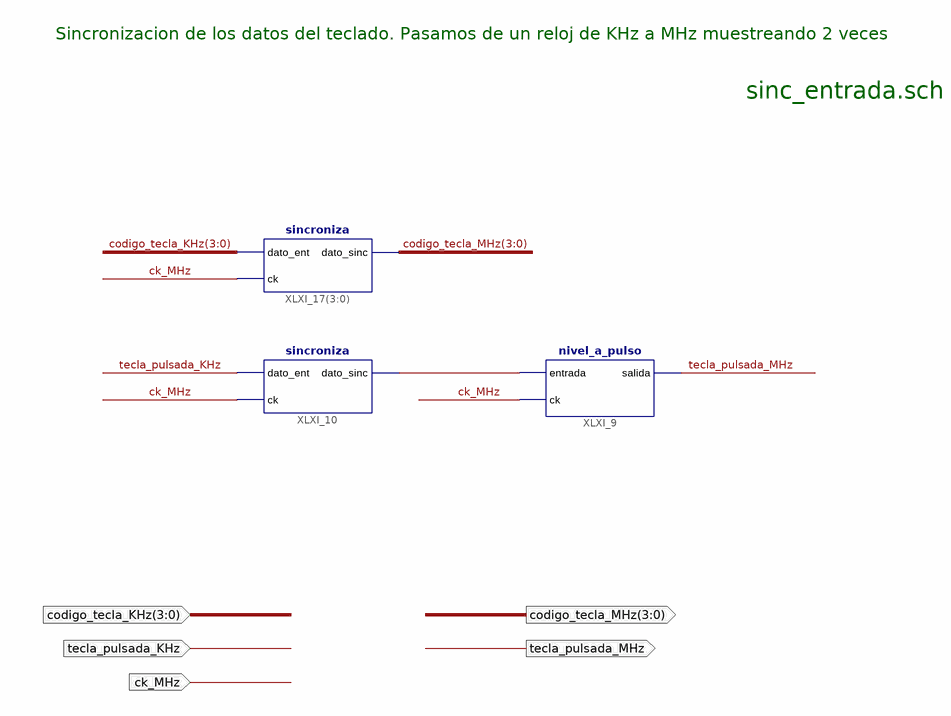
[diagram p0: schematic sheet 1]
// Xilinx ISE schematic sinc_entrada.sch (spartan6) as structural Verilog: 3 symbols, 5 ports
module sinc_entrada (
  input  [3:0] codigo_tecla_KHz,
  input  ck_MHz,
  input  tecla_pulsada_KHz,
  output [3:0] codigo_tecla_MHz,
  output tecla_pulsada_MHz
);

  wire XLXN_33;

  nivel_a_pulso XLXI_9 (.salida(tecla_pulsada_MHz), .ck(ck_MHz), .entrada(XLXN_33));
  sincroniza XLXI_10 (.dato_sinc(XLXN_33), .ck(ck_MHz), .dato_ent(tecla_pulsada_KHz));
  sincroniza XLXI_17[3:0] (.dato_sinc(codigo_tecla_MHz), .ck(ck_MHz), .dato_ent(codigo_tecla_KHz));

  // Notes on the sheet:
  //   Sincronizacion de los datos del teclado. Pasamos de un reloj de KHz a MHz muestreando 2 veces
  //   sinc_entrada.sch
endmodule
